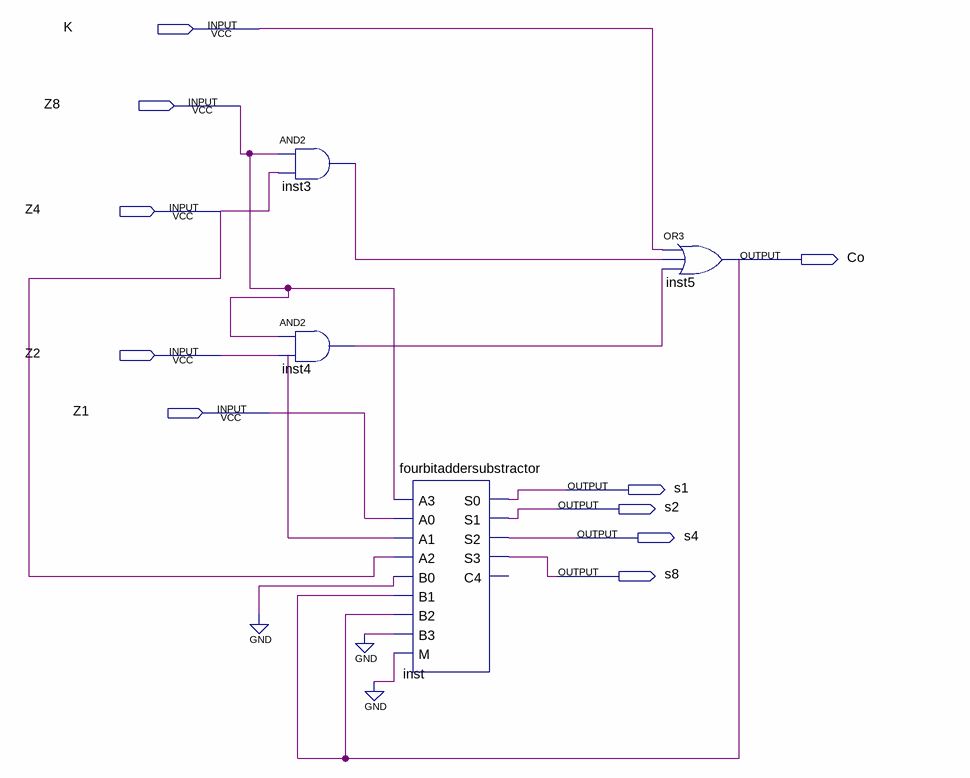
[diagram p0: schematic sheet]
// Quartus schematic controlunit.bdf as structural Verilog: 4 symbols, 10 pins
module controlunit (
  input  K,
  input  Z8,
  input  Z4,
  input  Z2,
  input  Z1,
  output Co,
  output s1,
  output s2,
  output s4,
  output s8
);

  wire inst3_out, inst4_out;

  and inst3 (inst3_out, Z8, Z4);
  and inst4 (inst4_out, Z8, Z2);
  fourbitaddersubstractor inst (
    .A3(Z8), .A0(Z1), .A1(Z2), .A2(Z4), .B0(1'b0), .B1(Co), .B2(Co), .B3(1'b0), .M(1'b0), .S0(s1), .S1(s2),
    .S2(s4), .S3(s8));  // open: C4
  or inst5 (Co, K, inst3_out, inst4_out);
endmodule
